# Altium schematic sheet MQ9_MQ2_LM35_PT100_IOT.SchDoc
size A; SheetNumber: 3; SheetTotal: 5
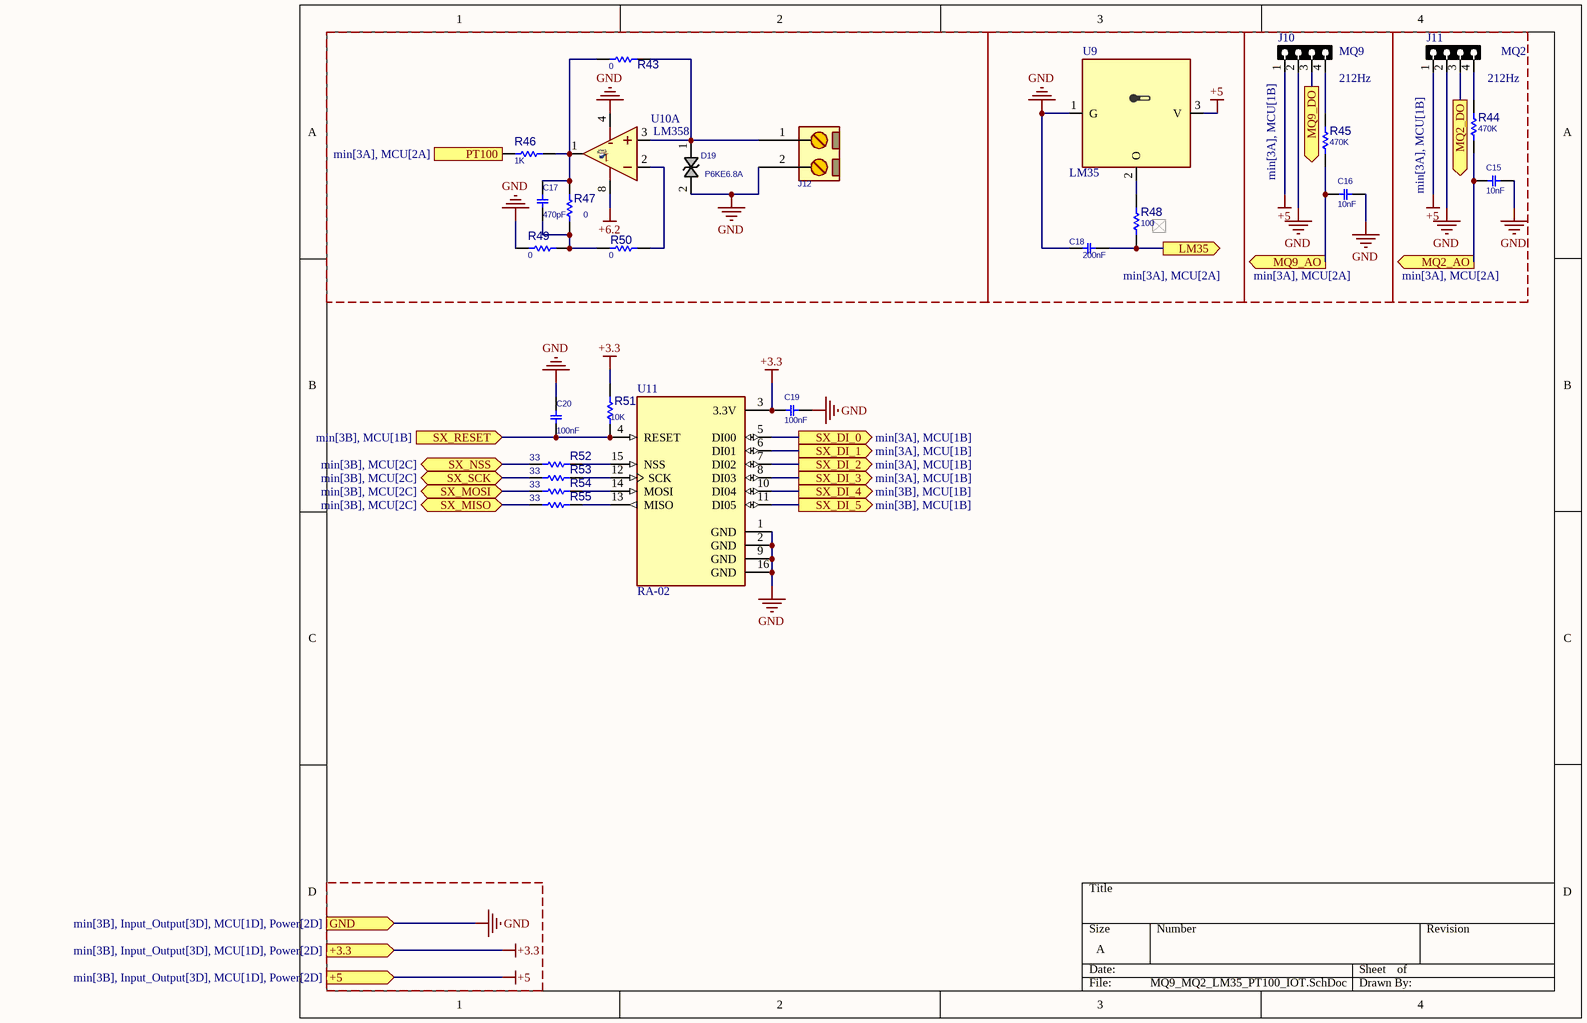
[diagram p0: MQ9_MQ2_LM35_PT100_IOT.SchDoc]

## Parts
C15  10nF  [C_CERM_D3]
C16  10nF  [C_CERM_D3]
C17  470pF  [C_CERM_D3]
C18  200nF  [C_CER_D5]
C19  100nF  [C_CERM_D3]
C20  100nF  [C_CERM_D3]
D19  P6KE6.8A  [D_AX05_DO15]
J10  MQ9  [HDR_F_1X4]
J11  MQ2  [HDR_F_1X4]
J12  CONN_GMSTB2  [GMSTB762_2]  (value not drawn)
R43  0  [R0125W_AX03]
R44  value 470K  [R025W_AX_VER]  (hidden comment: 100)
R45  value 470K  [R025W_AX_VER]  (hidden comment: 100)
R46  1K  [R0125W_AX03]
R47  0  [R0125W_AX03]
R48  100  [R025W_AX04]
R49  0  [R0125W_AX03]
R50  0  [R0125W_AX03]
R51  10K  [R0125W_AX03]
R52  33  [R1206]
R53  33  [R1206]
R54  33  [R1206]
R55  33  [R1206]
U9  LM35  [TO92_3]
U10  LM358  [DIP_8]  (part A of 2)
U11  RA-02  [RA-02]

## Ports
+3.3 (in, see min[3B], Input_Output[3D], MCU[1D], Power[2D]), +5 (in, see min[3B], Input_Output[3D], MCU[1D], Power[2D]), GND (in, see min[3B], Input_Output[3D], MCU[1D], Power[2D]), LM35 (out, see min[3A], MCU[2A]), MQ2_AO (out, see min[3A], MCU[2A]), MQ2_DO (out, see min[3A], MCU[1B]), MQ9_AO (out, see min[3A], MCU[2A]), MQ9_DO (out, see min[3A], MCU[1B]), PT100 (out, see min[3A], MCU[2A]), SX_DI_0 (out, see min[3A], MCU[1B]), SX_DI_1 (out, see min[3A], MCU[1B]), SX_DI_2 (out, see min[3A], MCU[1B]), SX_DI_3 (out, see min[3A], MCU[1B]), SX_DI_4 (out, see min[3B], MCU[1B]), SX_DI_5 (out, see min[3B], MCU[1B]), SX_MISO (bidir, see min[3B], MCU[2C]), SX_MOSI (bidir, see min[3B], MCU[2C]), SX_NSS (bidir, see min[3B], MCU[2C]), SX_RESET (in, see min[3B], MCU[1B]), SX_SCK (bidir, see min[3B], MCU[2C])

## Nets
+3.3: C19.2 R51.1 U11.3(3.3V) ; port +3.3
+5: J10.1 J11.1 U9.3(V) ; port +5
+6.2: U10.8(V+)
GND: C15.1 C16.1 C18.1 C19.1 C20.2 D19.2 J10.2 J11.2 J12.2 R49.2 U9.1(G) U10.4(V-) U11.1(GND) U11.2(GND) U11.9(GND) U11.16(GND) ; port GND
LM35: C18.2 R48.2 ; port LM35
MQ2_AO: C15.2 R44.1 ; port MQ2_AO
MQ2_DO: J11.3 ; port MQ2_DO
MQ9_AO: C16.2 R45.1 ; port MQ9_AO
MQ9_DO: J10.3 ; port MQ9_DO
PT100: R46.2 ; port PT100
SX_DI_0: U11.5(DI00) ; port SX_DI_0
SX_DI_1: U11.6(DI01) ; port SX_DI_1
SX_DI_2: U11.7(DI02) ; port SX_DI_2
SX_DI_3: U11.8(DI03) ; port SX_DI_3
SX_DI_4: U11.10(DI04) ; port SX_DI_4
SX_DI_5: U11.11(DI05) ; port SX_DI_5
SX_MISO: R55.1 ; port SX_MISO
SX_MOSI: R54.1 ; port SX_MOSI
SX_NSS: R52.1 ; port SX_NSS
SX_RESET: C20.1 R51.2 U11.4(RESET) ; port SX_RESET
SX_SCK: R53.1 ; port SX_SCK
NetC17_1: C17.1 R47.2 R49.1 R50.1
NetC17_2: C17.2 R43.2 R46.1 R47.1 U10.1(OUT)
NetD19_1: D19.1 J12.1 R43.1 U10.3(IN+)
NetJ10_4: J10.4 R45.2
NetJ11_4: J11.4 R44.2
NetR48_1: R48.1 U9.2(O)
NetR50_2: R50.2 U10.2(IN-)
NetR52_2: R52.2 U11.15(NSS)
NetR53_2: R53.2 U11.12(SCK)
NetR54_2: R54.2 U11.14(MOSI)
NetR55_2: R55.2 U11.13(MISO)

## Notes on the sheet
- (near J10) 212Hz
- 212Hz

## Library data of the parts
C15-C17 = CAP_THD_CER: CAP, THD, CER MULTI LAYER,; DESC: CAP, CER MULTI LAYER,; MANF_P#: MANF_PART#; PARAM2: 50V; PRICE: 100= 1$; MANF: MANF; ASSEMBLY: ASSEMBLY
  C15 C16: VALUE: 10nF
  C17: VALUE: 470pF
C18 = CAP_THD_CER: CAP, THD, CER MULTI LAYER,; DESC: CAP, CER MULTI LAYER,; MANF_P#: MANF_PART#; PARAM2: 50V; VALUE: 330nF; PRICE: 100= 1$; MANF: MANF; ASSEMBLY: ASSEMBLY
C19 C20 = CAP_THD_CER: CAP, THD, CER MULTI LAYER,; DESC: CAP, CER MULTI LAYER,; MANF_P#: MANF_PART#; PARAM2: 50V; VALUE: 470pF; PRICE: 100= 1$; MANF: MANF; ASSEMBLY: ASSEMBLY
D19 = TVS_P6KE27CA: TVS, ESD PROTECT, Bidirectional; MANF: ST, LittleFuse; PARAM2: 25.7~28.4VBr, 23VRM, 48.3VCLAMP; MANF_P#: P6KE27CA; VALUE: TVS_P6KE27
J10 J11 = HDR_F_1X4: CONN, HEADER, Female, pitch: 2.54mm, 4POS; VALUE: HDRF4
J12 = CONN_GMSTB762_2: CONN, PHOENIX GMSTB, 7.62mm pitch; MANF_P#: GMSTB 2,5/2-G-7,62; PARAM2: 630V; PARAM: 12A; VALUE: CONN_GMSTB2
R43-R47 R49 R50 = RES_THD: RESISTOR, THD; MANF_P#: RK73H1ETTP4701F; MANF: KOA SPEER; PARAM: 0.063W; DESC: DESCRIPTION; DIST#: MOUSER; PARAM2: 1%; ASSEMBLY: ASSEMBLY; PRICE: 100= 0.5$
  R43 R47 R49 R50: VALUE: 0
  R46: VALUE: 1K
R48 = RES_THD: RESISTOR, THD; MANF_P#: RK73H1ETTP4701F; MANF: KOA SPEER; PARAM: 0.063W; DESC: DESCRIPTION; DIST#: MOUSER; PARAM2: 1%; VALUE: 10K; ASSEMBLY: ASSEMBLY; PRICE: 100= 0.5$
R51 = RES_THD: RESISTOR, THD; MANF_P#: RK73H1ETTP4701F; MANF: KOA SPEER; PARAM: 0.063W; DESC: DESCRIPTION; DIST#: MOUSER; PARAM2: 1%; VALUE: 1K; ASSEMBLY: ASSEMBLY; PRICE: 100= 0.5$
R52-R55 = RES_SMD: RESISTOR, SMD; PARAM: -W; DESC: DESCRIPTION; DIST#: MOUSER; PARAM2: 1%; MANF_P#: -; MANF: -; ASSEMBLY: ASSEMBLY; PRICE: 100= 0.5$
U9 = TMP_LM35_TO92: SENSOR, TEMP, ANALOG, -55~150oC, 4~20Vcc, Out 0mV + 10mV/oC; MANF_P#: LM35CZ, LM35CAZ or LM35DZ; MANF: TI; PARAM: 0.5°C Accuracy, 10mV/oC, -55~150oC; PARAM2: 4~20Vcc; PRICE: 7$; VALUE: LM35
U10 = LM358_DIP8: AMP, Dual, Low-Power; MANF: Texas Instruments, Fairchild; MANF_P#: LM358AN; PARAM2: 3 V ~ 32 V, ±1.5 V ~ 16 V; PRICE: -; VALUE: LM358
U11 = RA-02: General ISM < 1GHz LoRaâ„¢ Transceiver Module 410MHz ~ 525MHz Antenna Not Included, I-PEX Surface Mount; MF: Ai-Thinker; SnapEDA_Link: https://www.snapeda.com/parts/RA-02/AI-Thinker/view-part/?ref=snap; Package: None; Value: *; MP: RA-02; Check_prices: https://www.snapeda.com/parts/RA-02/AI-Thinker/view-part/?ref=eda